# EAGLE design 4x board (EAGLE 9.6.2)
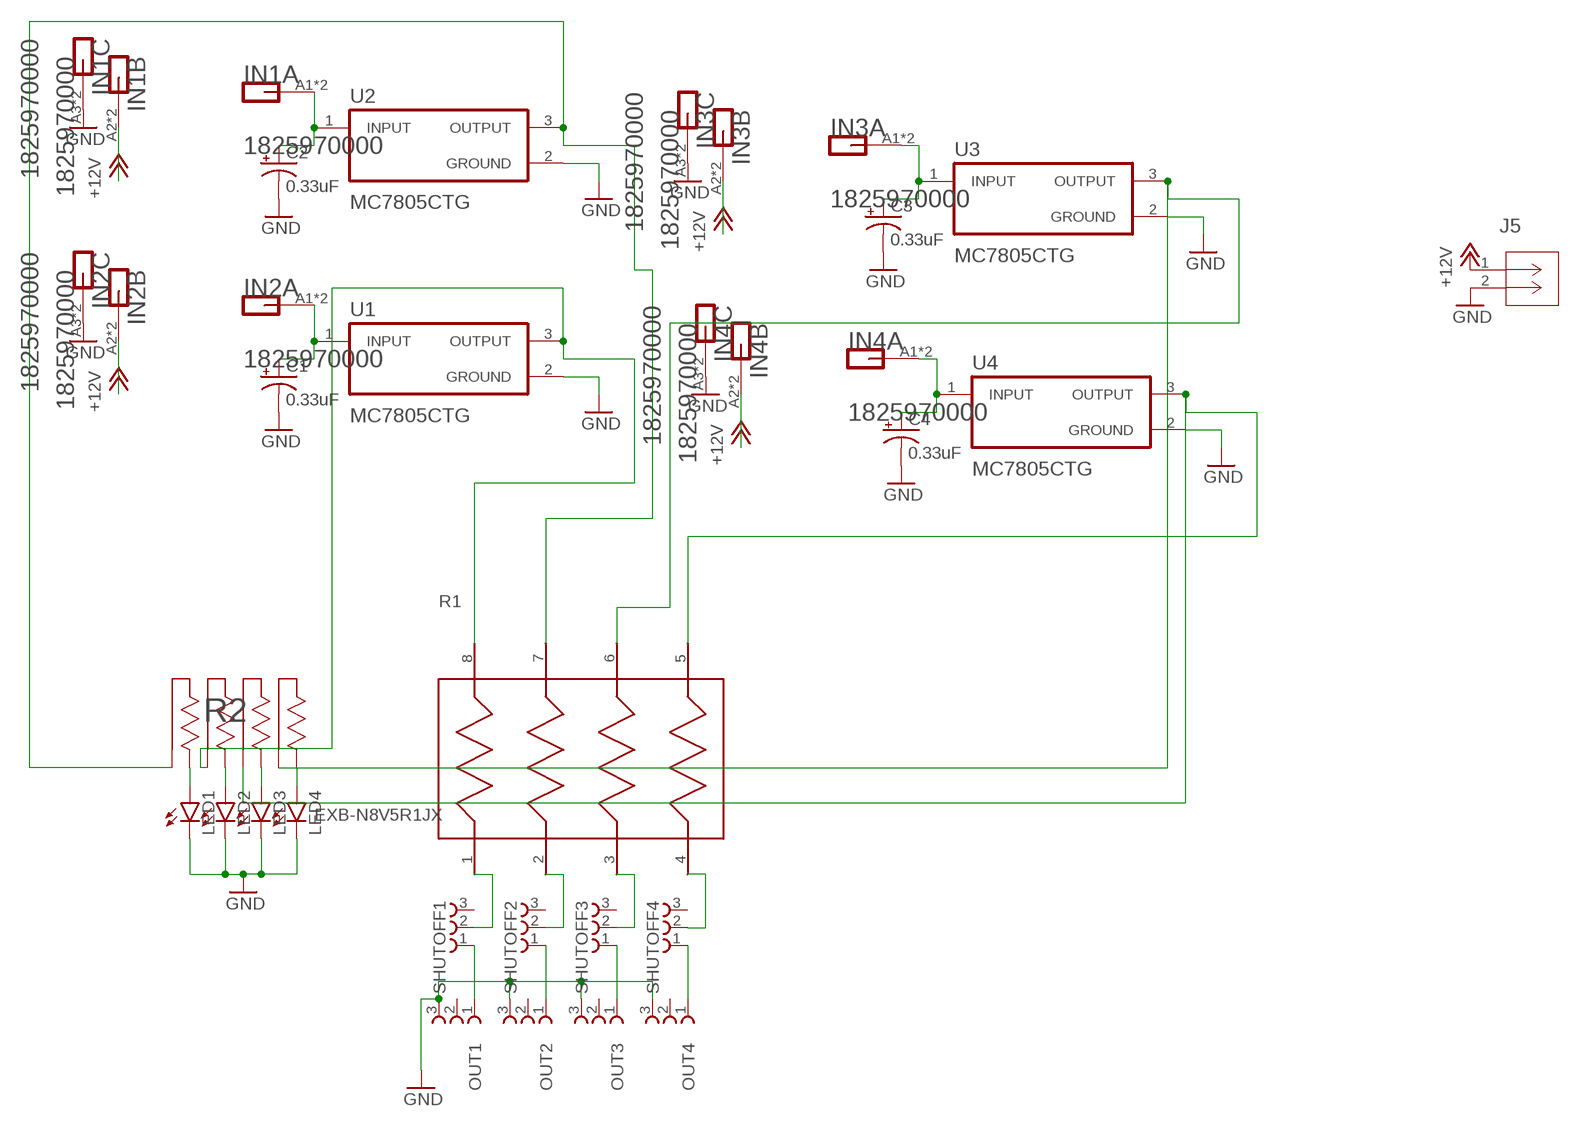
[diagram p0: schematic, sheet 1]

## Parts
C1  0.33uF  CPOL-USE2.5-5  [E2,5-5]
C2  0.33uF  CPOL-USE2.5-5  [E2,5-5]
C3  0.33uF  CPOL-USE2.5-5  [E2,5-5]
C4  0.33uF  CPOL-USE2.5-5  [E2,5-5]
IN1  WEIDMUELLER_1825970000WEIDMUELLER_1825970000_0_0  [WEIDMUELLER_1825970000_0]
IN2  WEIDMUELLER_1825970000WEIDMUELLER_1825970000_0_0  [WEIDMUELLER_1825970000_0]
IN3  WEIDMUELLER_1825970000WEIDMUELLER_1825970000_0_0  [WEIDMUELLER_1825970000_0]
IN4  WEIDMUELLER_1825970000WEIDMUELLER_1825970000_0_0  [WEIDMUELLER_1825970000_0]
J5  2606-3102/020-000  [CONN3_2606-3102/020-000_WAG]
LED1  LED3MM  [LED3MM]
LED2  LED3MM  [LED3MM]
LED3  LED3MM  [LED3MM]
LED4  LED3MM  [LED3MM]
OUT1  61300311121  [61300311121]
OUT2  61300311121  [61300311121]
OUT3  61300311121  [61300311121]
OUT4  61300311121  [61300311121]
R1  EXB-N8V5R1JX  [RESCAV50P200X100X55-8N]
R2  4608X-102-151LF  [BO_4608X]
SHUTOFF1  61300311121  [61300311121]
SHUTOFF2  61300311121  [61300311121]
SHUTOFF3  61300311121  [61300311121]
SHUTOFF4  61300311121  [61300311121]
U1  MC7805CTG  [TO254P1066X482X2286-3]
U2  MC7805CTG  [TO254P1066X482X2286-3]
U3  MC7805CTG  [TO254P1066X482X2286-3]
U4  MC7805CTG  [TO254P1066X482X2286-3]

## Nets
+12V [Big Wires]: IN1.A2 IN1.A2-2 IN2.A2 IN2.A2-2 IN3.A2 IN3.A2-2 IN4.A2 IN4.A2-2 J5.1
GND [Big Wires]: C1.- C2.- C3.- C4.- IN1.A3 IN1.A3-2 IN2.A3 IN2.A3-2 IN3.A3 IN3.A3-2 IN4.A3 IN4.A3-2 J5.2 LED1.K(C) LED2.K(C) LED3.K(C) LED4.K(C) OUT1.3 OUT2.3 OUT3.3 OUT4.3 U1.2(GROUND) U2.2(GROUND) U3.2(GROUND) U4.2(GROUND)
N$1: R1.8 R2.3 U1.3(OUTPUT)
N$2: C1.+ IN2.A1 IN2.A1-2 U1.1(INPUT)
N$3: R1.1 SHUTOFF1.2
N$4: R1.7 R2.1 U2.3(OUTPUT)
N$5: R1.6 R2.7 U3.3(OUTPUT)
N$6: C3.+ IN3.A1 IN3.A1-2 U3.1(INPUT)
N$7: R1.2 SHUTOFF2.2
N$8: C4.+ IN4.A1 IN4.A1-2 U4.1(INPUT)
N$9: R1.3 SHUTOFF3.2
N$10: R1.4 SHUTOFF4.2
N$11: R1.5 R2.5 U4.3(OUTPUT)
N$13: OUT1.1 SHUTOFF1.1
N$14: OUT2.1 SHUTOFF2.1
N$15: OUT3.1 SHUTOFF3.1
N$16: OUT4.1 SHUTOFF4.1
N$17: LED1.A R2.2
N$18: LED2.A R2.4
N$19: LED3.A R2.6
N$20: LED4.A R2.8
N$23: C2.+ IN1.A1 IN1.A1-2 U2.1(INPUT)
Unconnected: OUT1.2 OUT2.2 OUT3.2 OUT4.2 SHUTOFF1.3 SHUTOFF2.3 SHUTOFF3.3 SHUTOFF4.3

## Library data of the parts
C1-C4 = adafruit:CPOL-US: POLARIZED CAPACITOR, American symbol
IN1-IN4 = Weidmueller - 1825970000:WEIDMUELLER_1825970000: Terminal_03_1x03_Single; CIIVA_IDS: 21164068; COLOUR: Black; COMPONENT_LINK_1_DESCRIPTION: Manufacturer URL; COMPONENT_LINK_1_URL: http://www.weidmueller.com/; COMPONENT_LINK_2_DESCRIPTION: URL Link1; COMPONENT_LINK_2_URL: http://catalog.weidmueller.com/catalog/Start.do?localeId=en&ObjectID=1825970000; CONTACT_MATERIAL: Cu-Leg; CONTACT_SURFACE: tinned; FOOTPRINT_VARIANT_NAME_0: Manufacturer Recommended; IMPORTED: yes; IMPORTED_FROM: vault; IMPORT_TS: 1521858898; INSULATING_MATERIAL: LCP GF; MF: Weidmueller; MOUNTING_ONTO_THE__PCB: Reflow solder connection; MPN: 1825970000; NO_OF_POLES: 3; PACKAGE: LSF_SMT_5_00_180_03; PACKAGING: Tube; PITCH_INCH: 0,197 inch; PITCH_MM: 5 mm; PREFIX: E; QTY: 39 PCS; RATED_CURRENT_MIN_NO_OF_POLES__TU__20_DEG__C: 19 A; RATED_CURRENT_USE_GROUP__B__UL__1059: 12 A; RATED_VOLTAGE_FOR_SURGE_VOLTAGE_CLASS_POLLUTION_DEGREE__II__2: 500 V; RATED_VOLTAGE_USE_GROUP__B__UL__1059: 300 V; RELEASE_DATE: 1441960214; REVISION: V1; SHORT_TEXT_FOR_MATERIAL: LSF-SMT 5.00/03/180 3.5SN BK TU; SIDE_TERMINATION_CHARACTERISTIC: closed side; SOLDER_PIN_LENGTH_MM: 3,5 mm; SOLID_MAX__H_05__07__V__U: 1,5 mm2; SOLID_MIN__H_05__07__V__U: 0,2 mm2; UL__94_FLAMMABILITY_RATING: V-0; VAULT_GUID: 03F9458B-A2E0-419D-AF66-8D59BC483EAA; VAULT_REVISION: F6AF1825-5669-4E81-89AF-BD44428CA1E3; WIRE_CROSS_SECTION__AWG_MAX__UL__1059: AWG 16; WIRE_CROSS_SECTION__AWG_MIN__UL__1059: AWG 24
J5 = my parts:2606-3102/020-000; COPYRIGHT: Copyright (C) 2021 Ultra Librarian. All rights reserved.; MANUFACTURER_PART_NUMBER: 2606-3102/020-000; MFR_NAME: Wago
LED1-LED4 = led:LED: LED OSRAM: - CHIPLED LG R971, LG N971, LY N971, LG Q971, LY Q971, LO R971, LY R971 LH N974, LH R974 LS Q976, LO Q976, LY Q976 LO Q996 - Hyper CHIPLED LW Q18S LB Q993, LB Q99A, LB R99A - SideLED LS A670, LO A670, LY A670, LG A670, LP A670 LB A673, LV A673, LT A673, LW A673 LH A674 LY A675 LS A676, LA A676, LO A676, LY A676, LW A676 LS A679, LY A679, LG A679 - Hyper Micro SIDELED® LS Y876, LA Y876, LO Y876, LY Y876 LT Y87S - SmartLED LW L88C, LW L88S LB L89C, LB L89S, LG L890 LS L89K, LO L89K, LY L89K LS L896, LA L896, LO L896, LY L896 - TOPLED LS T670, LO T670, LY T670, LG T670, LP T670 LSG T670, LSP T670, LSY T670, LOP T670, LYG T670 LG T671, LOG T671, LSG T671 LB T673, LV T673, LT T673, LW T673 LH T674 LS T676, LA T676, LO T676, LY T676, LB T676, LH T676, LSB T676, LW T676 LB T67C, LV T67C, LT T67C, LS T67K, LO T67K, LY T67K, LW E67C LS E67B, LA E67B, LO E67B, LY E67B, LB E67C, LV E67C, LT E67C LW T67C LS T679, LY T679, LG T679 LS T770, LO T770, LY T770, LG T770, LP T770 LB T773, LV T773, LT T773, LW T773 LH T774 LS E675, LA E675, LY E675, LS T675 LS T776, LA T776, LO T776, LY T776, LB T776 LHGB T686 LT T68C, LB T68C - Hyper Mini TOPLED® LB M676 - Mini TOPLED Santana® LG M470 LS M47K, LO M47K, LY M47K Source: http://www.osram.convergy.de LUXEON: - LUMILED® LXK2-PW12-R00, LXK2-PW12-S00, LXK2-PW14-U00, LXK2-PW14-V00 LXK2-PM12-R00, LXK2-PM12-S00, LXK2-PM14-U00 LXK2-PE12-Q00, LXK2-PE12-R00, LXK2-PE12-S00, LXK2-PE14-T00, LXK2-PE14-U00 LXK2-PB12-K00, LXK2-PB12-L00, LXK2-PB12-M00, LXK2-PB14-N00, LXK2-PB14-P00, LXK2-PB14-Q00 LXK2-PR12-L00, LXK2-PR12-M00, LXK2-PR14-Q00, LXK2-PR14-R00 LXK2-PD12-Q00, LXK2-PD12-R00, LXK2-PD12-S00 LXK2-PH12-R00, LXK2-PH12-S00 LXK2-PL12-P00, LXK2-PL12-Q00, LXK2-PL12-R00 Source: www.luxeon.com KINGBRIGHT: KA-3528ASYC Source: www.kingbright.com
OUT1-OUT4 SHUTOFF1-SHUTOFF4 = 61300311121:61300311121: WR-PHD 5.54mm Pin Header, 3 Pin =>Code : Con_BTB_PHD_2.54_1_THT_61300311121 <http://katalog.we-online.de/media/images/eican/Con_BTB_PHD_2.54_1_THT_6130xx11121_pf2.jpg> Details see: http://katalog.we-online.de/en/em/613_0xx_111_21 Created 2014-05-29, Karrer Zheng 2014 (C) Würth Elektronik Check prices <https://pricing.snapeda.com/parts/61300311121/W%C3%BCrth%20Elektronik/view-part?ref=eda>; AVAILABILITY: In Stock; DESCRIPTION: Connector Header Through Hole 3 position 0.100 (2.54mm); MF: Würth Elektronik; MP: 61300311121; PACKAGE: None; PRICE: None; PURCHASE-URL: https://pricing.snapeda.com/search/part/61300311121/?ref=eda
R1 = EXB-N8V5R1JX:EXB-N8V5R1JX: Res Thick Film Array 1K Ohm 5% ±200ppm/°C ISOL Molded 8-Pin 0804(4 X 0402) Concave SMD Punched Carrier T/R; DESCRIPTION: 5.1 Ohm ±5% 31mW Power Per Element Isolated Resistor Network/Array ±200ppm/°C 0804, Concave, Long Side Terminals; DIGI-KEY_PART_NUMBER: Y105R1CT-ND; MF: Panasonic; MP: EXB-N8V5R1JX; PACKAGE: 0804 Panasonic; PURCHASE-URL: https://pricing.snapeda.com/search/part/EXB-N8V5R1JX/?ref=eda
R2 = my parts:4608X-102-151LF; COPYRIGHT: Copyright (C) 2021 Ultra Librarian. All rights reserved.; DIGI-KEY_PART_NUMBER_1: 4608X-2-151LF-ND; MANUFACTURER_PART_NUMBER: 4608X-102-151LF; MFR_NAME: Bourns Electronics
U1-U4 = MC7805CTG:MC7805CTG: None Check prices <https://pricing.snapeda.com/parts/MC7805CTG/ON%20Semiconductor/view-part?ref=eda>; AVAILABILITY: In Stock; DESCRIPTION: Linear Voltage Regulator, Positive, 5.0 V, 1.0 A Vout: 5.0 V; TJ = 0°C to +125°C; MF: ON Semiconductor; MP: MC7805CTG; PACKAGE: TO-220-3 ON Semiconductor; PRICE: None; PURCHASE-URL: https://pricing.snapeda.com/search/part/MC7805CTG/?ref=eda

## Net classes
1 Big Wires: width 0.305 mm

## Board
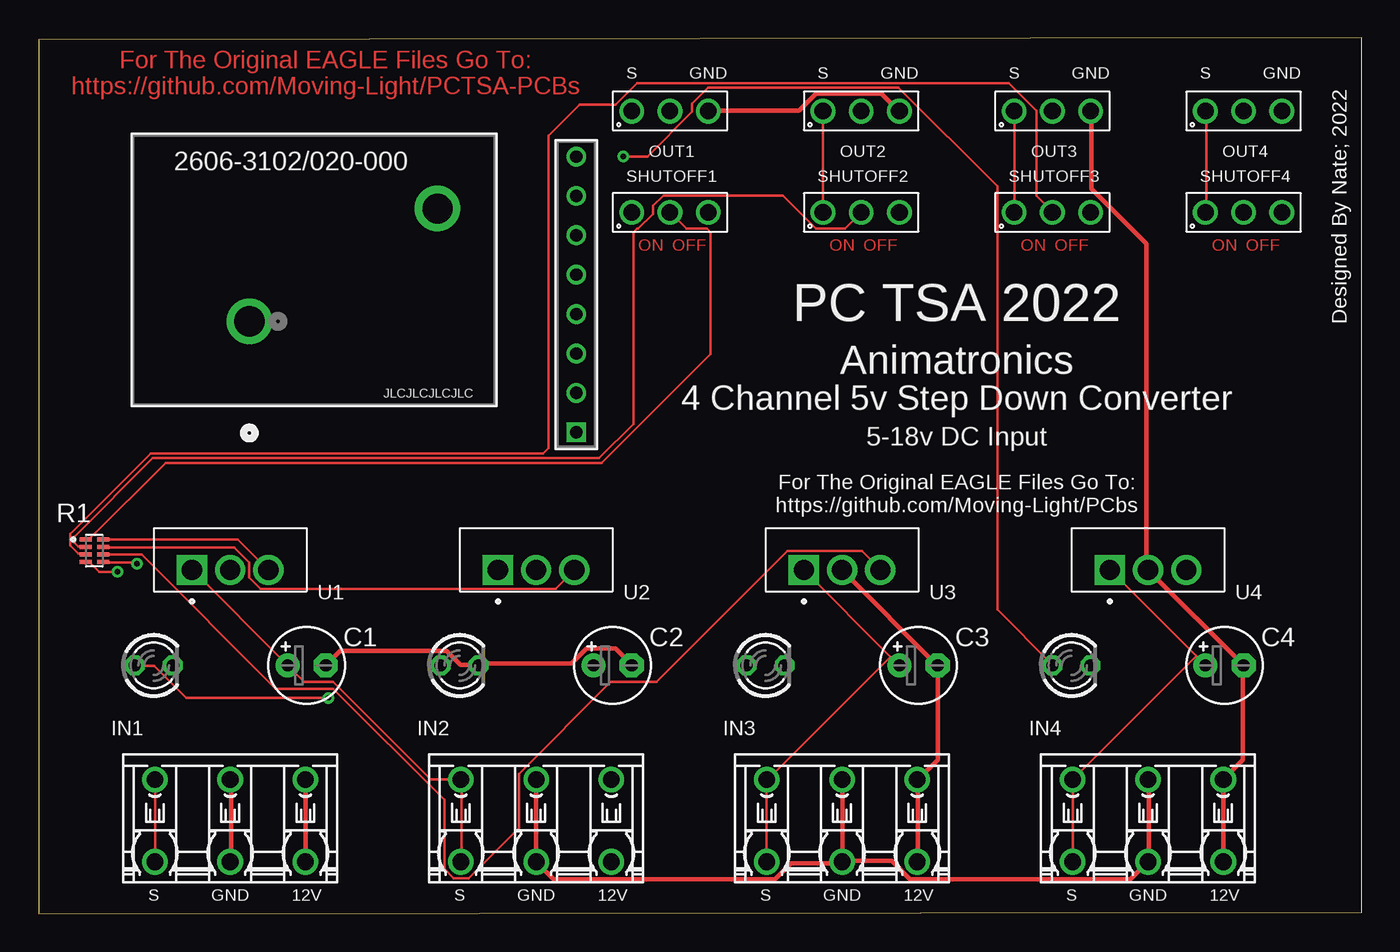
[diagram p1: board, top side]
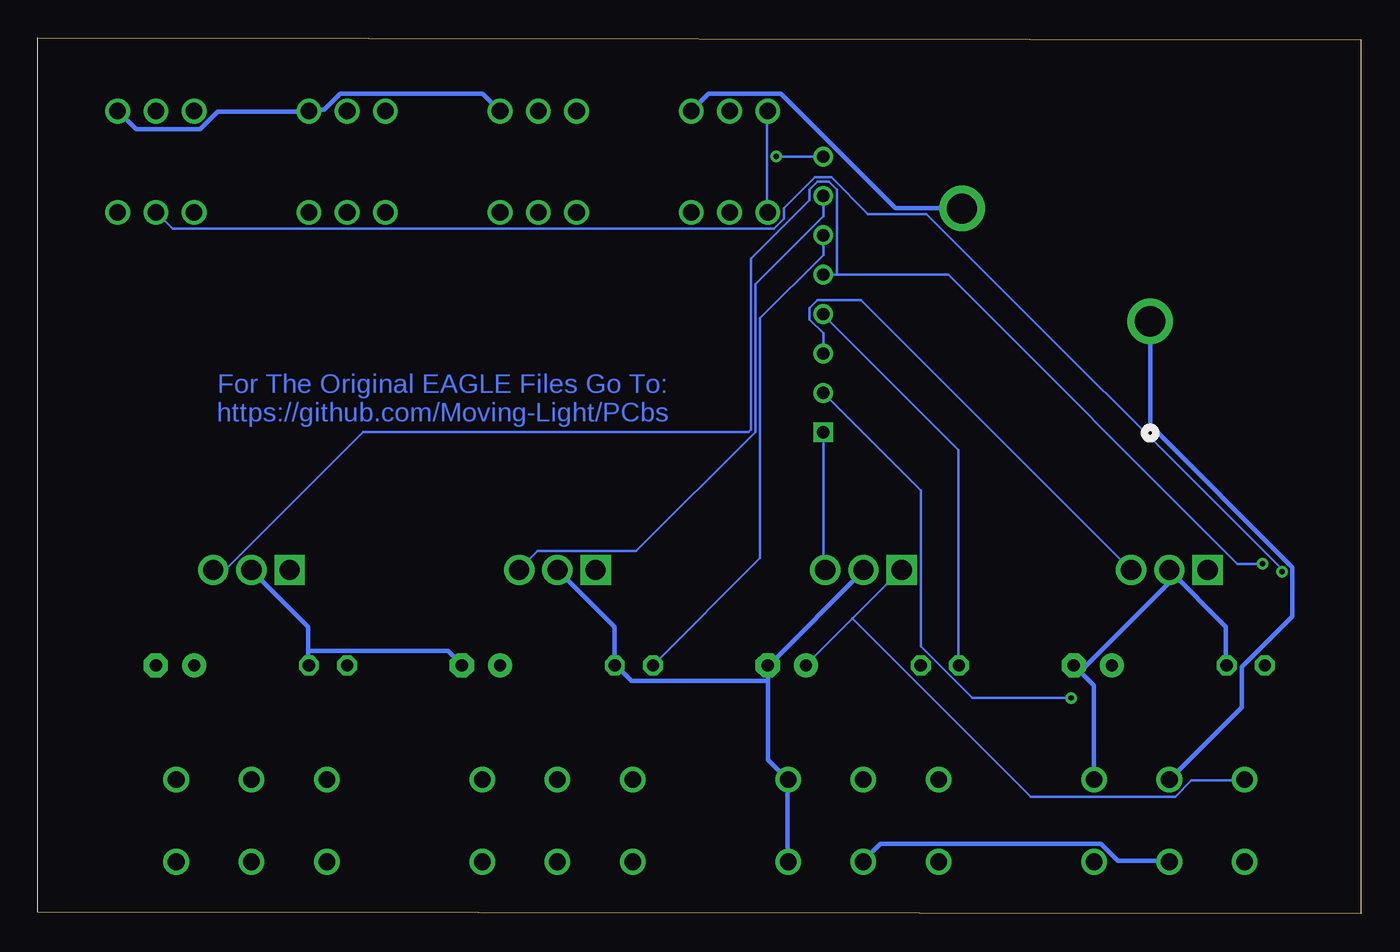
[diagram p2: board, bottom side, seen from below]

Size 87.86 x 58.22 mm. Coordinates in mm from the lower left corner, seen from the top.
Outline: 0,0 87.86,0.13 87.86,58.22 0,58.09 0,0
Copper layers (1*16): Top 0.035mm / dielectric 1.5mm / Bottom 0.035mm
Design rules "default": minimum track width 6mil, minimum drill 0.35mm, track to track 6mil, track to pad 6mil, pad to pad 6mil, via to via 6mil, smd to smd 6mil, copper to edge 40mil, drill to drill 6mil, minimum pad ring 10mil, minimum via ring 8mil, stop-mask expansion 4mil, vias tented up to drill 0mil, thermal gap 10mil

### Footprints (pad centres in the part's own frame; a part is rotated, then mirrored left to right if it is on the bottom)
E2,5-5 = drill 0.813 pad 1.6: + -1.27,0 | drill 0.813 pad 1.6 octagon: - 1.27,0
WEIDMUELLER_1825970000_0 = drill 1.1 pad 1.7: A1 -5,-2.88; A1-2 -5,2.58; A2 0,-2.88; A2-2 0,2.58; A3 5,-2.88; A3-2 5,2.58
CONN3_2606-3102/020-000_WAG = drill 2.007 pad 2.515: 1 0,0; 2 7.493,-12.497
LED3MM = drill 0.813 octagon: A -1.27,0; K 1.27,0
61300311121 = drill 1.1: 1 -2.54,0; 2 0,0; 3 2.54,0
RESCAV50P200X100X55-8N = smd 0.87 x 0.29: 1 -0.58,0.75; 2 -0.58,0.25; 3 -0.58,-0.25; 4 -0.58,-0.75; 5 0.58,-0.75; 6 0.58,-0.25; 7 0.58,0.25; 8 0.58,0.75
BO_4608X = drill 0.813 pad 1.321 square: 1 0,0 | drill 0.813 pad 1.321: 2 2.616,0; 3 5.232,0; 4 7.849,0; 5 10.465,0; 6 13.081,0; 7 15.697,0; 8 18.313,0
TO254P1066X482X2286-3 = drill 1.34 pad 2.01 square: 1 0,0 | drill 1.34 pad 2.01: 2 2.54,0; 3 5.08,0

### Placement (x,y rotation side)
C1  17.78,16.51 0 top
C2  38.1,16.51 0 top
C3  58.42,16.51 0 top
C4  78.74,16.51 0 top
IN1  12.7,6.35 0 top
IN2  33.02,6.35 0 top
IN3  53.34,6.35 0 top
IN4  73.66,6.35 0 top
J5  13.97,39.37 90 top
LED1  7.62,16.51 0 top
LED2  27.94,16.51 0 top
LED3  48.26,16.51 0 top
LED4  68.58,16.51 0 top
OUT1  41.91,53.34 0 top
OUT2  54.61,53.34 0 top
OUT3  67.31,53.34 0 top
OUT4  80.01,53.34 0 top
R1  3.68,24.13 0 top
R2  35.69,32 90 top
SHUTOFF1  41.91,46.61 0 top
SHUTOFF2  54.61,46.61 0 top
SHUTOFF3  67.31,46.61 0 top
SHUTOFF4  80.01,46.61 0 top
U1  10.16,22.86 0 top
U2  30.48,22.86 0 top
U3  50.8,22.86 0 top
U4  71.12,22.86 0 top

### Tracks (layer width: path | path; a pad name or v marks a point on that pad's centre or on a via)
+12V
  Top 0.305: IN3.A2 53.36,3.53 53.36,8.86 IN3.A2-2 | IN4.A2-2 73.71,8.86 73.71,3.53 IN4.A2 73.56,3.38 72.49,2.31 57.86,2.31 56.64,3.53 53.52,3.53 IN3.A2 | IN1.A2 12.75,3.53 12.75,8.86 IN1.A2-2 | IN2.A2-2 IN2.A2 33.1,3.38 34.16,2.31 48.87,2.31 49.94,3.38 53.21,3.38 IN3.A2
  Bottom 0.305: IN1.A2 12.75,3.53 16.1,3.53 17.25,4.67 31.88,4.67 33.02,3.53 IN2.A2 | J5.1 13.97,32.49 4.52,23.04 4.52,19.76 7.87,16.41 7.87,13.74 12.68,8.94 IN1.A2-2
GND
  Top 0.305: OUT1.3 44.45,53.37 50.47,53.37 51.61,54.51 55.96,54.51 57.1,53.37 OUT2.3 | IN1.A3 17.7,3.53 17.7,8.86 IN1.A3-2 | C1.- 19.07,16.56 19.99,17.47 27.08,17.47 27.99,16.56 29.21,16.56 LED2.K 29.29,16.64 35.38,16.64 36.37,17.63 38.28,17.63 39.34,16.56 C2.- | IN4.A3 78.66,3.53 78.66,8.79 IN4.A3-2 79.96,10.24 79.96,16.48 C4.- U4.2 73.56,22.96 73.56,44.53 69.9,48.18 69.9,53.29 OUT3.3 | IN3.A3 58.39,3.53 58.39,8.79 IN3.A3-2 58.39,8.94 59.69,10.24 C3.- 59.61,16.56 53.36,22.81 U3.2
  Bottom 0.305: OUT4.3 82.47,53.29 81.33,52.15 77.06,52.15 75.92,53.29 69.9,53.29 OUT3.3 69.75,53.44 68.83,53.44 67.77,54.51 58.32,54.51 57.17,53.37 OUT2.3 | J5.2 26.47,46.89 30.89,46.89 38.51,54.51 43.31,54.51 44.45,53.37 OUT1.3 | LED1.K 8.94,16.56 8.94,19.07 12.68,22.81 U1.2 12.37,22.35 18.54,16.18 C1.- 19,16.48 17.7,15.19 IN1.A3-2 | 69.9,17.47 69.9,19.07 73.64,22.81 U4.2 | 69.9,17.47 69.9,16.56 LED4.K | 39.34,15.49 39.34,10.24 38.05,8.94 IN2.A3-2 38.05,8.79 38.05,3.53 IN2.A3 | 39.34,15.49 39.34,16.48 C2.- 39.27,16.56 33.02,22.81 U2.2 | U3.2 49.55,19.07 49.55,16.56 LED3.K 49.4,16.48 48.41,15.49 39.34,15.49 | 69.9,17.47 60.6,17.47 59.69,16.56 C3.-
N$1
  Top 0.152: R1.8 4.29,24.87 13.21,24.87 15.19,22.88 U1.3
  Bottom 0.152: R2.3 35.69,38.58 36.6,39.5 36.6,40.26 36.07,40.79 33.17,40.79 U1.3
N$2
  Top 0.152: IN2.A1 28.07,3.53 28.07,8.86 IN2.A1-2 27.99,8.94 26.01,8.94 19.53,15.42 17.63,15.42 16.56,16.48 C1.+ 16.48,16.56 10.16,22.88 U1.1
N$3
  Top 0.152: SHUTOFF1.2 43,45.52 44.37,45.52 44.6,45.29 44.6,37.21 37.36,29.97 8.41,29.97 3.38,24.94 3.15,24.94 R1.1
N$4
  Top 0.152: R1.7 4.29,24.33 12.98,24.33 13.97,23.34 13.97,22.35 14.73,21.59 34.31,21.59 35.53,22.81 U2.3
  Bottom 0.152: R2.1 35.69,22.96 35.61,22.88 U2.3
N$5
  Top 0.152: R1.6 4.29,23.88 6.81,23.88 15.72,14.96 19.53,14.96 26.92,7.57 26.92,3 27.53,2.39 28.52,2.39 31.88,5.74 31.88,9.32 37.97,15.42 41.02,15.42 49.71,24.1 54.66,24.1 55.88,22.88 U3.3
  Bottom 0.152: R2.7 35.69,46.35 40.18,41.86 40.18,32.03 48.11,24.1 54.66,24.1 55.88,22.88 U3.3
N$6
  Top 0.152: IN3.A1 48.34,3.53 48.34,8.86 IN3.A1-2 48.41,8.94 56.57,17.09 | U3.1 56.57,17.09 | 56.57,17.09 C3.+
N$7
  Top 0.152: SHUTOFF2.2 53.52,45.52 51.61,45.52 49.4,47.73 41.48,47.73 40.79,47.04 40.79,46.51 39.8,45.52 39.73,45.52 39.5,45.29 39.5,32.56 37.21,30.28 7.57,30.28 2.39,25.09 2.39,24.64 2.62,24.41 3.07,24.41 R1.2
N$8
  Top 0.152: IN4.A1 68.68,3.53 68.68,8.86 IN4.A1-2 68.68,8.94 76.87,17.13 | 76.87,17.13 71.12,22.88 U4.1 | 76.87,17.13 77.45,16.56 C4.+
N$9
  Top 0.152: R1.3 3.07,23.95 2.62,23.95 2.08,24.49 2.08,25.25 7.42,30.58 33.48,30.58 33.86,30.96 33.86,51.69 35.92,53.75 38.28,53.75 39.73,55.19 64.41,55.19 66.24,53.37 66.24,47.73 67.31,46.66 SHUTOFF3.2
N$10  (via drill 0.35)
  Top 0.152: v5.21,22.73 3.99,22.73 3.38,23.34 3.15,23.34 R1.4
  Bottom 0.152: v5.21,22.73 5.21,22.88 28.83,46.51 32.71,46.51 35.15,48.95 36.22,48.95 38.28,46.89 38.28,46.2 38.96,45.52 78.89,45.52 79.96,46.58 SHUTOFF4.2
N$11  (via drill 0.35)
  Top 0.152: v6.5,23.27 6.43,23.34 4.29,23.34 R1.5
  Bottom 0.152: v6.5,23.27 8.18,23.27 27.38,42.47 34.77,42.47 | R2.5 34.77,42.47 | 34.77,42.47 34.77,48.11 35.31,48.64 36.07,48.64 36.6,48.11 36.6,47.42 40.49,43.54 40.49,32.18 40.64,32.03 66.24,32.03 75.39,22.88 76.15,22.88 U4.3
N$13
  Bottom 0.152: SHUTOFF1.1 39.42,46.66 39.42,53.29 OUT1.1
N$14
  Top 0.152: SHUTOFF2.1 52.07,53.29 OUT2.1
N$15
  Top 0.152: OUT3.1 64.8,53.29 64.8,46.66 SHUTOFF3.1
N$16
  Top 0.152: OUT4.1 77.52,53.29 77.52,46.66 SHUTOFF4.1
N$17  (via drill 0.35)
  Top 0.152: v19.23,14.35 9.78,14.35 7.64,16.48 6.35,16.48 LED1.A
  Bottom 0.152: v19.23,14.35 25.78,14.35 29.21,17.78 29.21,28.14 R2.2
N$18
  Bottom 0.152: LED2.A 26.7,16.56 26.7,30.81 35.69,39.8 R2.4
N$19
  Bottom 0.152: R2.6 35.69,43.76 39.88,39.57 39.88,23.65 46.96,16.56 LED3.A
N$20  (via drill 0.35)
  Top 0.152: v38.81,50.32 40.41,50.32 43.38,53.29 43.38,53.82 44.45,54.89 57.1,54.89 63.65,48.34 63.65,20.22 67.31,16.56 LED4.A
  Bottom 0.152: v38.81,50.32 R2.8
N$23
  Top 0.152: IN1.A1 7.72,3.53 7.72,8.86 IN1.A1-2
  Bottom 0.152: 33.74,19.65 30.5,22.88 U2.1 | 33.74,19.65 36.83,16.56 C2.+ | 33.74,19.65 21.89,7.8 12.29,7.8 11.23,8.86 7.72,8.86 IN1.A1-2

### Text on the board
Top: For The Original EAGLE Files Go To: / https://github.com/Moving-Light/PCTSA-PCBs | ON | OFF | ON | OFF | ON | OFF | ON | OFF
Bottom: For The Original EAGLE Files Go To: / https://github.com/Moving-Light/PCbs
tNames: S | GND | S | GND | S | GND | S | GND | Designed By Nate; 2022 | PC TSA 2022 | Animatronics | JLCJLCJLCJLC | 4 Channel 5v Step Down Converter | 5-18v DC Input | For The Original EAGLE Files Go To: / https://github.com/Moving-Light/PCbs | S | GND | 12V | S | GND | 12V | S | GND | 12V | S | GND | 12V